# EAGLE board SUMO ROBOT (EAGLE 7.6.0)
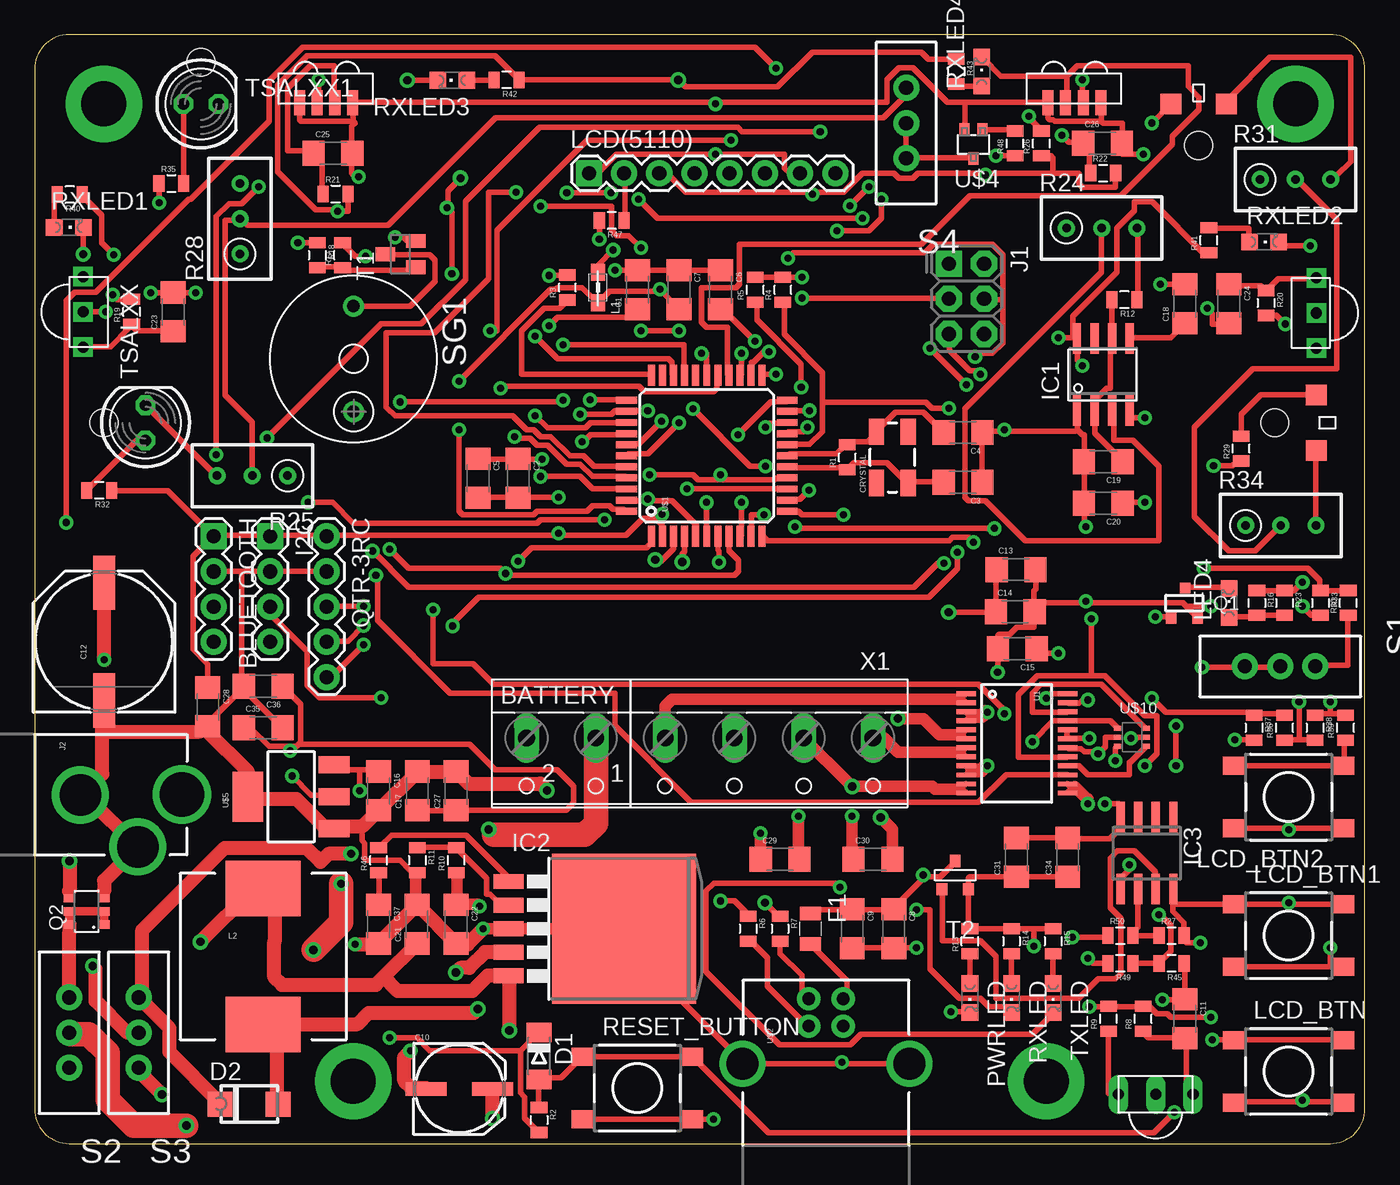
[diagram p2: board, top side]
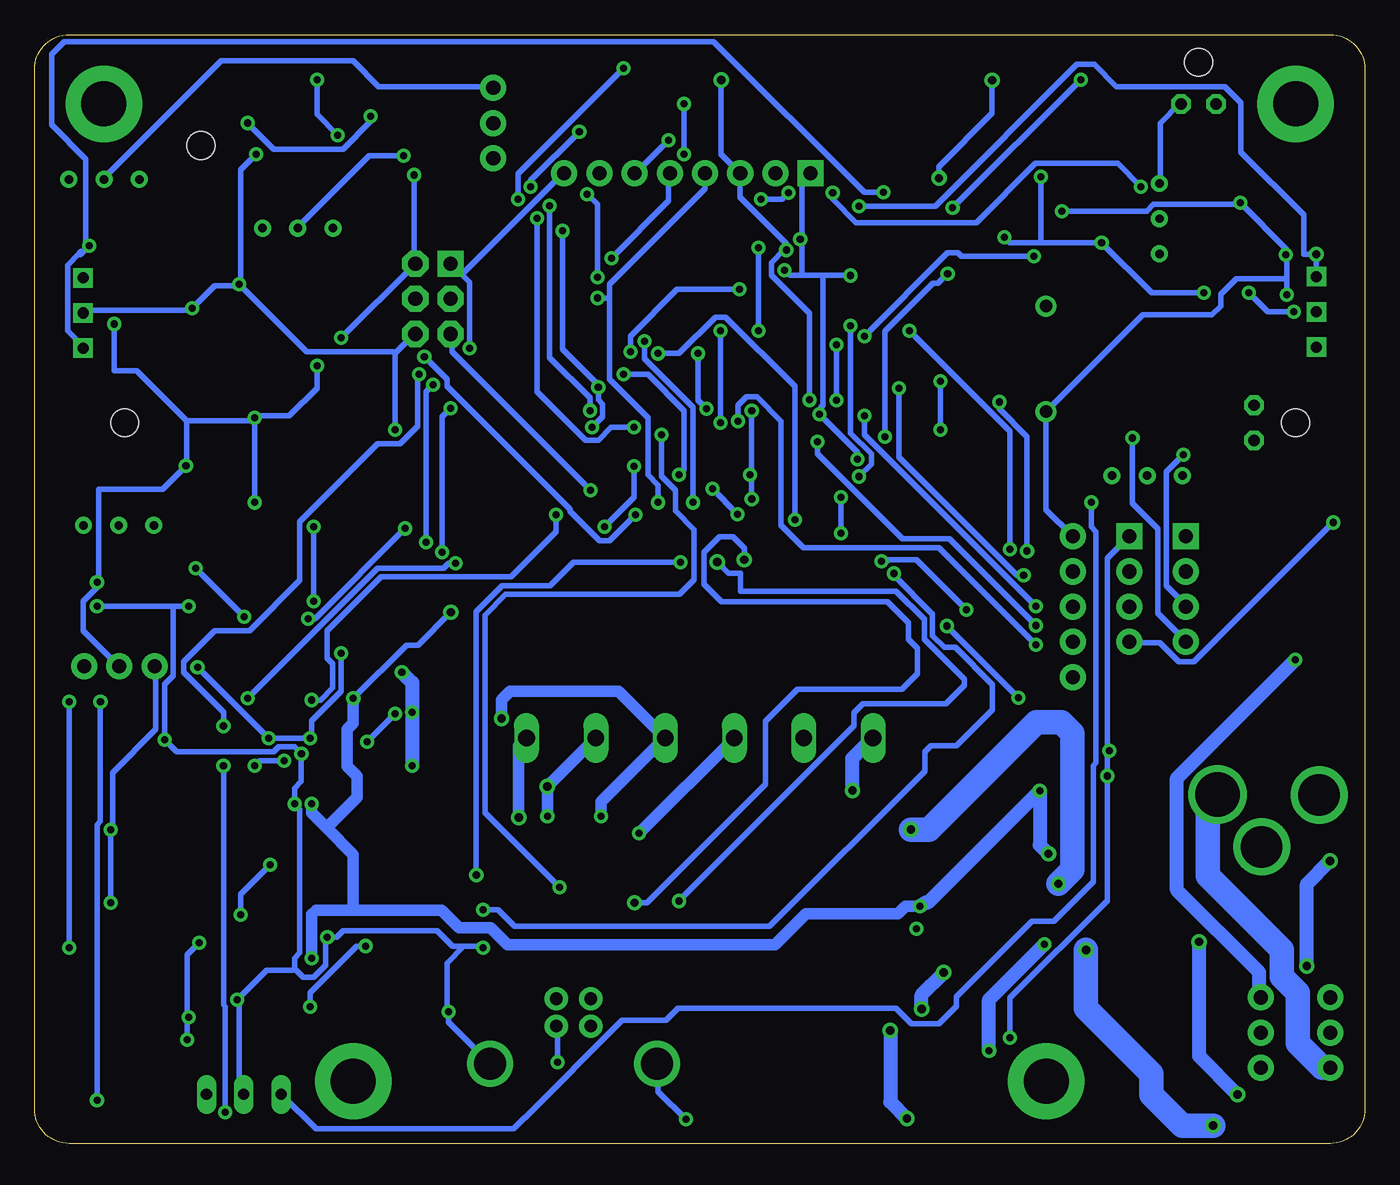
[diagram p3: board, bottom side, seen from below]

Size 96 x 80 mm. Coordinates in mm from the lower left corner, seen from the top.
Outline: 93.5,80 2.5,80 arc90 0,77.5 0,2.5 arc90 2.5,0 93.5,0 arc90 96,2.5 96,77.5 arc90 93.5,80
Copper layers (1*16): Top 0.035mm / dielectric 1.5mm / Bottom 0.035mm
Design rules "SparkFun": minimum track width 8mil, minimum drill 20mil, track to track 8mil, track to pad 8mil, pad to pad 8mil, via to via 8mil, smd to smd 8mil, copper to edge 10mil, drill to drill 8mil, minimum pad ring 12mil, minimum via ring 10mil, stop-mask expansion 4mil, vias tented up to drill 25mil, thermal gap 10mil
Net classes: 0 default: width 0.406 mm, drill 0.254 mm, clearance 0.203 mm; 1 supply: width 1.016 mm, drill 0.254 mm, clearance 0.203 mm
Holes 2 mm at 12,78 84,72 5,52 89.5,52

## Footprints (pad centres in the part's own frame; a part is rotated, then mirrored left to right if it is on the bottom)
W237-102 = drill 1.194 long: 1 -2.5,-1.27; 2 2.5,-1.27
1X04 = drill 1.016 pad 1.88 square: 1 0,0 | drill 1.016 pad 1.88: 2 2.54,0; 3 5.08,0; 4 7.62,0
1206 = smd 1.6 x 1.8: 1 -1.4,0; 2 1.4,0
NIPPON_F80 = smd 2.95 x 1: + 2.4,0; - -2.4,0
PANASONIC_G = smd 3.9 x 1.6: + 4.25,0; - -4.25,0
CRYSTAL-SMD-5X3 = smd 1.9 x 1.1: 1 -1.85,-1.15; 2 1.85,-1.15; 3 1.85,1.15; 4 -1.85,1.15
MINIMELF = smd 1.4 x 1.8: A 1.7,0; C -1.7,0
SMA = smd 1.8 x 1.8: 1 -2.1,-0.1; 2 2.1,-0.1
PTC0805 = smd 1 x 1.5: 1 -1.1,0; 2 1.1,0
SOIC-8 = smd 0.6 x 2.2: 1 -1.905,-2.6; 2 -0.635,-2.6; 3 0.635,-2.6; 4 1.905,-2.6; 5 1.905,2.6; 6 0.635,2.6; 7 -0.635,2.6; 8 -1.905,2.6
TO263-5 = smd 1.067 x 2.159: 1 -3.404,-5.791; 2 -1.702,-5.791; 3 0,-5.791; 4 1.702,-5.791; 5 3.404,-5.791 | smd 10.8 x 10.41: 6 0,2.54
SO08 = smd 0.6 x 2.2: 1 -1.905,-2.6; 2 -0.635,-2.6; 3 0.635,-2.6; 4 1.905,-2.6; 5 1.905,2.6; 6 0.635,2.6; 7 -0.635,2.6; 8 -1.905,2.6
2X3-NS = drill 1.016 pad 1.88 square: 1 -2.54,-1.27 | drill 1.016 pad 1.88 octagon: 2 -2.54,1.27; 3 0,-1.27; 4 0,1.27; 5 2.54,-1.27; 6 2.54,1.27
POWER_JACK_PTH_LOCK = drill 2.997 pad 4.115: GND 0.025,6.557; GNDBREAK 3.762,10.7 | drill 3.2 pad 4.115: PWR 0,13.878
0805 = smd 1.2 x 1: 1 -1.1,0; 2 1.1,0
CDRH125 = smd 5.4 x 4: 1 0,4.9; 2 0,-4.9
1X08 = drill 1.016 pad 1.88 square: 1 0,0 | drill 1.016 pad 1.88: 2 2.54,0; 3 5.08,0; 4 7.62,0; 5 10.16,0; 6 12.7,0; 7 15.24,0; 8 17.78,0
DTSM-6 = smd 1.55 x 1.3: 1 -3.975,2.25; 2 3.975,2.25; 3 -3.975,-2.25; 4 3.975,-2.25
CHIPLED_0805 = smd 1.2 x 1.2: A 0,-1.05; C 0,1.05
SOT-23 = smd 0.762 x 0.762: 1 -0.979,-1.101; 2 0.94,-1.101; 3 0.025,1.067
SOT23-6 = smd 0.6 x 0.8: 1 -0.95,-1.25; 2 0,-1.25; 3 0.95,-1.25; 4 0.95,1.25; 5 0,1.25; 6 -0.95,1.25
1X05 = drill 1.016 pad 1.88: 1 0,0; 2 2.54,0; 3 5.08,0; 4 7.62,0; 5 10.16,0
0805' = smd 0.8 x 1.2: 1 -0.9,0; 2 0.9,0
RTRIM3296W = drill 0.61: 1 0,-2.54; 2 0,0; 3 0,2.54
SWITCH-SPDT = drill 1.016 pad 1.88: 1 0,2.54; 2 0,0; 3 0,-2.54
BMT1205XH7.5 = drill 0.9 pad 1.5: + 3.8,0; - -3.8,0
SOT23-BEC = smd 1 x 1.4: B -0.95,-1.1; C 0,1.1; E 0.95,-1.1
SOT-23' = smd 0.787 x 0.889: 1 0.025,-1.016; 2 -0.94,1.016; 3 0.991,1.016
LED5MM = drill 0.813 octagon: A -1.27,0; K 1.27,0
SSOP24 = smd 0.348 x 1.397: 1 -3.575,-3.656; 2 -2.925,-3.656; 3 -2.275,-3.656; 4 -1.625,-3.656; 5 -0.975,-3.656; 6 -0.325,-3.656; 7 0.325,-3.656; 8 0.975,-3.656; 9 1.625,-3.656; 10 2.275,-3.656; 11 2.925,-3.656; 12 3.575,-3.656; 13 3.575,3.656; 14 2.925,3.656; 15 2.275,3.656; 16 1.625,3.656; 17 0.975,3.656; 18 0.325,3.656; 19 -0.325,3.656; 20 -0.975,3.656; 21 -1.625,3.656; 22 -2.275,3.656; 23 -2.925,3.656; 24 -3.575,3.656
SPARKFUN-DIGITALIC_TQFP44 = smd 1.5 x 0.5: 1 -5.8,4; 2 -5.8,3.2; 3 -5.8,2.4; 4 -5.8,1.6; 5 -5.8,0.8; 6 -5.8,0; 7 -5.8,-0.8; 8 -5.8,-1.6; 9 -5.8,-2.4; 10 -5.8,-3.2; 11 -5.8,-4; 23 5.8,-4; 24 5.8,-3.2; 25 5.8,-2.4; 26 5.8,-1.6; 27 5.8,-0.8; 28 5.8,0; 29 5.8,0.8; 30 5.8,1.6; 31 5.8,2.4; 32 5.8,3.2; 33 5.8,4 | smd 0.5 x 1.5: 12 -4,-5.8; 13 -3.2,-5.8; 14 -2.4,-5.8; 15 -1.6,-5.8; 16 -0.8,-5.8; 17 0,-5.8; 18 0.8,-5.8; 19 1.6,-5.8; 20 2.4,-5.8; 21 3.2,-5.8; 22 4,-5.8; 34 4,5.8; 35 3.2,5.8; 36 2.4,5.8; 37 1.6,5.8; 38 0.8,5.8; 39 0,5.8; 40 -0.8,5.8; 41 -1.6,5.8; 42 -2.4,5.8; 43 -3.2,5.8; 44 -4,5.8
USB-B-PTH = drill 0.914 pad 1.676: D+ 0,1.25; D- 1.981,1.25; GND 0,-1.25; VBUS 1.981,-1.25 | drill 2.286: S1 -2.718,-6.02; S2 -2.718,6.02
OS-1838 = drill 0.8 pad 1.016 long: GND 2.7,1.3; OUT 0,1.3; VCC 5.4,1.3
SOT323 = smd 0.7 x 0.9: 1 -0.65,-1; 2 0.65,-1; 3 0,1.1
SOT223 = smd 1.219 x 2.235: 1 -2.311,-3.099; 2 0,-3.099; 3 2.311,-3.099 | smd 3.6 x 2.2: 4 0,3.099
TSSP7P38 = smd 0.8 x 1.8: 1 -1.94,-0.1; 2 -0.67,-0.1; 3 0.6,-0.1; 4 1.87,-0.1
TSSPXX38 = drill 0.8 square: GND 2.5,1; OUT -0.04,1; VS 5.04,1
SC-70-6 = smd 0.5 x 0.35: A1 -1.05,0.65; A2 -1.05,-0.65; GND -1.05,0; VCC 1.05,0; Y1 1.05,0.65; Y2 1.05,-0.65
IRLED = smd 1.5 x 1.5: P$1 -2,0; P$2 2,0
W237-4 = drill 1.194 long: 1 -7.5,-1.27; 2 -2.5,-1.27; 3 2.5,-1.27; 4 7.5,-1.27

## Placement (x,y rotation side)
BATTERY  [W237-102]  38,28 180 top
BLUETOOTH  [1X04]  12.92,43.81 270 top
C1  100nF  [1206]  43.5,61.6 90 top
C2  100nF  [1206]  34.9,48 270 top
C3  22pF  [1206]  67,47.7 180 top
C4  22pF  [1206]  67,51.3 180 top
C5  100nF  [1206]  32,48 270 top
C6  1uF  [1206]  49.5,61.6 270 top
C7  1uF  [1206]  46.5,61.6 270 top
C8  10uF  [1206]  62,15.5 270 top
C9  100nF  [1206]  59,15.5 270 top
C10  47uF  [NIPPON_F80]  30.65,3.94 0 top
C11  47uF  [1206]  83,9 270 top
C12  680uF  [PANASONIC_G]  5.02,36.21 90 top
C13  10uF  [1206]  70.82,41.41 0 top
C14  100nF  [1206]  70.77,38.37 0 top
C15  100nF  [1206]  70.92,35.69 180 top
C16  10uF  [1206]  24.82,25.44 270 top
C17  10uF  [1206]  27.62,25.44 90 top
C18  10nF  [1206]  83,60.58 90 top
C19  470pF  [1206]  77.12,49.19 180 top
C20  100nF  [1206]  77.12,46.19 180 top
C21  1uF  [1206]  27.59,15.83 90 top
C22  1uF  [1206]  30.42,15.83 270 top
C23  100nF  [1206]  10,60 90 top
C24  100nF  [1206]  86.18,60.58 270 top
C25  100nF  [1206]  21.53,71.45 0 top
C26  100nF  [1206]  77.06,72.17 0 top
C27  100nF  [1206]  30.42,25.44 90 top
C28  100nF  [1206]  12.5,31.5 270 top
C29  100nF  [1206]  53.8,20.5 0 top
C30  100nF  [1206]  60.5,20.5 0 top
C31  100nF  [1206]  70.84,20.65 90 top
C34  100nF  [1206]  74.55,20.65 90 top
C35  100nF  [1206]  16.5,30 0 top
C36  100nF  [1206]  16.5,33 180 top
C37  0.33uF  [1206]  24.82,15.83 270 top
CRYSTAL  16MHZ  [CRYSTAL-SMD-5X3]  61.9,49.5 90 top
D1  [MINIMELF]  36.4,6.32 270 top
D2  [SMA]  15.47,2.93 0 top
F1  [PTC0805]  56,15.5 270 top
I2C  [1X04]  17,43.81 270 top
IC1  IC_555-SOIC8  [SOIC-8]  77.12,55.49 0 top
IC2  LM2577S  [TO263-5]  40,15.5 270 top
IC3  LMV358MX  [SO08]  80.27,20.95 180 top
J1  AVR_SPI_PRG_6NS  [2X3-NS]  67.25,60.95 270 top
J2  POWER_JACKPTH_LOCK  [POWER_JACK_PTH_LOCK]  -3.25,25.17 270 top
L1  MH2029-300Y  [0805]  40.65,61.76 90 top
L2  [CDRH125]  16.5,13.5 0 top
LCD(5110)  [1X08]  40,70 0 top
LCD_BTN  DTSM-6  [DTSM-6]  90.5,5.2 0 top
LCD_BTN1  DTSM-6  [DTSM-6]  90.5,15 0 top
LCD_BTN2  DTSM-6  [DTSM-6]  90.5,25 180 top
LED4  [CHIPLED_0805]  86.2,39 0 top
PWRLED  [CHIPLED_0805]  67.5,10.5 180 top
Q1  [SOT-23]  83,39 0 top
Q2  SI3456BDVSOT-5-6  [SOT23-6]  3.76,16.75 90 top
QTR-3RC  [1X05]  21.08,43.81 270 top
R1  1M  [0805']  58.65,49.5 90 top
R2  10K  [0805']  36.4,1.7 270 top
R3  10K  [0805']  38.45,61.76 90 top
R4  4.7K  [0805']  54,61.6 90 top
R5  4.7K  [0805']  52,61.6 90 top
R6  22R  [0805']  51.5,15.5 270 top
R7  22R  [0805']  53.8,15.5 270 top
R8  47R  [0805']  80,9 90 top
R9  20K  [0805']  77.5,9 90 top
R10  10.5K  [0805']  30.42,20.43 90 top
R11  2K  [0805']  27.62,20.43 270 top
R12  39.2K  [0805']  78.65,60.88 180 top
R13  220R  [0805']  67.5,14.6 90 top
R14  1K  [0805']  70.5,14.6 270 top
R15  1K  [0805']  73.5,14.6 270 top
R16  1K  [0805']  88.2,39 270 top
R17  1K  [0805']  22.23,64.09 90 top
R18  10K  [0805']  20.41,64.09 270 top
R19  100R  [0805']  7,60 90 top
R20  100R  [0805']  88.87,60.64 270 top
R21  100R  [0805']  21.73,68.5 0 top
R22  100R  [0805']  77.11,70.01 0 top
R23  1K  [0805']  90.2,39 270 top
R24  10k  [RTRIM3296W]  77.01,66.05 270 top
R25  1k  [RTRIM3296W]  15.71,48.18 90 top
R26  47R  [0805']  72.65,72.15 90 top
R27  4.7K  [0805']  82.05,15 0 top
R28  1k  [RTRIM3296W]  14.82,66.72 0 top
R29  47R  [0805']  87.07,50.14 90 top
R30  10K  [0805']  94.8,39 90 top
R31  1k  [RTRIM3296W]  90.99,69.56 270 top
R32  47R  [0805']  4.66,47.12 180 top
R33  47K  [0805']  92.8,39 270 top
R34  1k  [RTRIM3296W]  89.93,44.59 270 top
R35  47R  [0805']  9.87,69.26 0 top
R36  1K  [0805']  90.2,30 90 top
R37  10K  [0805']  88,30 270 top
R38  7.5K  [0805']  92.4,30 270 top
R39  68K  [0805']  94.6,30 90 top
R40  1K  [0805']  2.54,68.46 180 top
R41  1K  [0805']  84.73,65.18 90 top
R42  1K  [0805']  34.06,76.73 180 top
R43  1K  [0805']  66.5,77.34 270 top
R45  10K  [0805']  82.05,13 180 top
R46  2.2K  [0805']  24.82,20.43 90 top
R47  220R  [0805']  41.65,66.59 180 top
R48  100R  [0805']  70.75,72.15 90 top
R49  4.7K  [0805']  78.35,13 180 top
R50  2.2K  [0805']  78.35,15 0 top
RESET_BUTTON  DTSM-6  [DTSM-6]  43.5,4 0 top
RXLED  [CHIPLED_0805]  70.5,10.5 180 top
RXLED1  [CHIPLED_0805]  2.46,66.1 270 top
RXLED2  [CHIPLED_0805]  88.72,65.05 270 top
RXLED3  [CHIPLED_0805]  30.15,76.71 90 top
RXLED4  [CHIPLED_0805]  68.35,77.34 0 top
S1  [SWITCH-SPDT]  89.89,34.42 270 top
S2  [SWITCH-SPDT]  2.5,8 180 top
S3  [SWITCH-SPDT]  7.5,8 180 top
S4  [SWITCH-SPDT]  62.9,73.62 180 top
SG1  BMT1205XH7.5  [BMT1205XH7.5]  23.01,56.61 270 top
T1  [SOT23-BEC]  26.4,64.16 90 top
T2  [SOT-23']  66.46,19.36 180 top
TSALXX  [LED5MM]  8,52 90 top
TSALXX1  [LED5MM]  12,75 0 top
TXLED  [CHIPLED_0805]  73.5,10.5 180 top
U1  TB6612FNG  [SSOP24]  70.88,28.87 270 top
U$1  ATMEGA32U4TQFP  [SPARKFUN-DIGITALIC_TQFP44]  48.51,49.62 90 top
U$2  USB+SHIELD  [USB-B-PTH]  57.11,8.47 90 top
U$3  OS-1838  [OS-1838]  78.2,2.25 0 top
U$4  DMG1012UW  [SOT323]  67.75,72.15 180 top
U$5  NCP1117  [SOT223]  18.51,25.03 90 top
U$6  TSSP7P38  [TSSP7P38]  21,75 180 top
U$7  TSSP7P38  [TSSP7P38]  75,75 180 top
U$8  TSSPXX38  [TSSPXX38]  93.5,57.42 90 top
U$9  TSSPXX38  [TSSPXX38]  2.5,62.5 270 top
U$10  NC7WZ14(NOTGATE)  [SC-70-6]  79.19,29.31 0 top
U$11  IRLED  [IRLED]  84,75 180 top
U$12  IRLED  [IRLED]  92.5,52 90 top
X1  [W237-4]  53,28 180 top

## Tracks (layer width: path | path; a pad name or v marks a point on that pad's centre or on a via)
2,6
  Top 0.406: R12.2 77.75,58.12 IC1.6 77.62,58 77.62,54.5 77.38,54.5 76.62,53.75 76.62,53 IC1.2 76.5,52.88 76.5,51.25 78.5,49.25 C19.1
38KHZOUT  (via drill 0.51)
  Top 0.406: v69.38,71.25 R48.1 | IC1.3 77.88,52.88 77.88,50.75 79.25,50.75 81.12,48.88 81.12,43.5 71.5,43.5 68.62,46.38 67.38,46.38 67.12,46.62 67.12,53 77,62.88 77,66 R24.2
  Bottom 0.406: v69.38,71.25 71.88,71.25 77,66.12 R24.2
+5V  (via drill 0.51, 0.6)
  Top 0.406: R16.1 88.25,39.88 90.12,39.88 R23.1 90.38,39.88 90.88,39.88 v91.5,40.5 | S1.2 89.88,34.38 87.38,34.38 S1.3 87.25,34.38 v84.25,34.38 | 74.62,29.25 v76.12,29.25 | 74.62,29.25 U1.19 | U1.20 74.5,29.75 74.5,29.38 74.62,29.25 | v73.88,35.38 72.38,35.38 72.38,35.62 C15.1 | 72.12,15.5 R14.1 R13.2 67.38,15.5 67.38,18.25 T2.2 67.38,18.5 67.38,19.12 67.5,19.25 70.64,19.25 | 72.12,15.5 R15.1 | 70.64,19.25 74.5,19.25 C34.1 | v76.12,9.88 77.38,9.88 R9.2 77.5,9.88 80,9.88 R8.2 80.12,9.88 80.5,9.88 81,9.38 81.75,9.38 82,9.12 v84.88,9.12 | 72.12,15.5 v72.12,14.25 | LCD_BTN2.1 90.5,22.75 | 90.5,22.75 LCD_BTN2.2 | LCD_BTN.2 94.38,7.5 86.62,7.5 LCD_BTN.1 86.38,7.5 v85,7.5 | 82.12,17.25 82.12,18.25 IC3.8 | 82.12,17.25 82.12,16.75 82.95,15.93 R27.2 | 83,15 R27.2 | 82.12,17.25 LCD_BTN1.1 90.5,17.25 | 90.5,17.25 LCD_BTN1.2 | v84.12,14.5 83.12,14.5 83,14.62 83,14.88 R27.2 | v90.5,22.62 90.5,22.75 | v90.5,17.38 90.5,17.25 | v80.12,52.38 79,52.38 79,52.88 IC1.4 | v90.25,59.12 89.62,59.75 R20.2 | v80.12,46.25 78.62,46.25 C20.1 | v73.88,58.12 75.12,58.12 IC1.8 | R5.2 R4.2 v55.38,62.5 | 68.62,70 63.75,70 63.38,69.62 62.38,69.62 62,70 59.75,70 58.38,68.62 56.12,68.62 | 68.62,70 73.5,70 | 73.5,70 75.38,70 75.38,69.25 75.62,69 78,69 R22.2 | 56.12,68.62 47,68.62 45.62,70 LCD(5110).3 | R26.1 73.38,71.25 73.5,71.12 73.5,70 | v56.12,68.5 56.12,68.62 | v68.62,69.88 68.62,70 | v75.62,56.12 75.25,56.5 75.25,58 IC1.8 | 36.38,8 D1.C 36.27,7.92 35.05,6.71 | C27.1 30.38,24 27.62,24 C17.1 | v5.62,61.25 6,60.88 7,60.88 R19.2 | v9,67.88 9,69.25 R35.1 | R21.2 22.62,67.25 v21.88,67.25 21.79,67.36 20.27,67.36 17.53,70.1 17.53,76.35 19.66,78.49 33.22,78.49 34.9,76.81 R42.1 v46.46,76.73 46.97,76.22 53.62,76.22 56.13,78.74 64.01,78.74 64.5,78.24 R43.1
  Top 0.406: C5.2 32,46.62 34.88,46.62 C2.2 35.05,46.63 v37.8,46.63 | v79.12,29.25 79.52,29.25 79.58,29.31 U$10.VCC | R41.1 84.45,64.14 80.64,67.94 79.38,67.94 79.38,67.31 78.11,66.04 78.11,62.87 74.93,59.69 74.93,58.42 IC1.8 | R40.1 3.44,68.37 4.85,66.95 4.85,65 v5.71,64.14 | v85.08,48.89 86.44,48.89 86.56,49.01 86.84,49.01 R29.1 | C31.1 70.64,19.25 | v41.76,64.47 40.69,63.4 40.69,62.94 L1.2 | v40.08,53.65 42.67,53.65 U$1.34 | 44.88,45.03 44.81,45.11 43.89,45.11 42.67,43.89 37.8,43.89 | 44.88,45.03 45.26,44.65 45.26,43.89 U$1.2 | 37.8,43.89 21.18,43.89 QTR-3RC.1 21.03,43.89 17.07,43.89 I2C.1 16.92,43.89 13.11,43.89 BLUETOOTH.1 | v47.09,47.24 54.25,47.24 U$1.14 | 44.88,45.03 v45.26,45.41 | v37.8,44.04 37.8,43.89 | 18.44,28.65 18.9,28.65 19.13,28.88 | 18.44,28.65 16.92,28.65 15.7,29.87 15.24,29.87 C35.1 | 19.13,28.88 19.2,28.96 19.2,31.7 17.98,32.92 C36.1 | 30.48,23.93 C27.1 | 19.13,28.88 19.2,28.8 31.39,28.8 33.22,26.98 37.69,26.98 38.89,25.78 38.89,24.59 38.35,24.05 30.43,24.05 C27.1 | R32.1 5.64,47.09 9.6,47.09 12.8,43.89 BLUETOOTH.1 | C28.1 12.5,32.92 12.5,34.59 11.43,35.66 11.43,42.37 12.8,43.74 BLUETOOTH.1 | 35.05,6.71 35.05,3.66 35.36,3.35 35.36,1.83 36.27,0.91 R2.2 | v18.59,26.52 19.96,25.15 21.49,25.15 U$5.2 | 35.05,6.71 28.5,6.71 27.58,7.62 v25.6,7.62 | v18.44,28.35 18.44,28.65
  Bottom 0.406: S1.2 90,34.5 92.5,37 92.5,39.12 91.5,40.12 v91.5,40.5 91.38,40.62 91.38,47.22 86.75,47.22 v85.08,48.89 85.03,48.94 85.03,52.16 | v73.88,35.38 73.88,32.62 76,30.5 76,29.38 v76.12,29.25 v79.12,29.25 v84.25,34.38 | v76.12,9.88 76.12,10.88 72.75,14.25 v72.12,14.25 | 85,9.12 85,13.62 v84.12,14.5 | 85,9.12 v85,7.5 | v90.5,17.38 v90.5,22.62 90.38,22.75 90.38,26.75 87.25,29.88 87.25,34.38 S1.3 | v84.88,9.12 85,9.12 | v90.25,59.12 90.25,55.75 88.62,55.75 85.03,52.16 | v80.12,52.38 v80.12,46.25 | v73.88,58.12 68.62,63.38 J1.2 68.62,63.62 v68.62,69.88 | v55.38,62.5 55.38,67.75 v56.12,68.5 | v75.62,56.12 75.62,54.5 77.62,52.5 80,52.5 v80.12,52.38 | 5.62,64.14 5.62,64.5 v9,67.88 9.12,67.75 15.25,67.75 15.75,67.25 v21.88,67.25 | 5.62,64.14 5.62,62.38 | 5.62,62.38 v5.62,61.25 | 5.62,62.38 9.29,62.38 10.41,61.26 10.41,60.42 11.03,59.8 16.02,59.8 SG1.+ 23.01,45.74 QTR-3RC.1 | v5.71,64.14 5.62,64.14 | v46.46,76.73 46.46,71.38 LCD(5110).3 45.11,69.8 45.11,68.28 41.76,64.92 v41.76,64.47 41.91,64.47 42.82,63.55 42.82,62.64 40.08,59.89 v40.08,53.65 | 85.03,52.16 80.34,52.16 v80.12,52.38 | v45.26,45.41 v47.09,47.24 | v37.8,44.04 v37.8,46.63 | 18.59,28.35 18.59,42.22 17.07,43.74 I2C.1 | 18.59,28.35 v18.59,26.52 18.59,17.53 25.6,10.52 v25.6,7.62 | v18.44,28.35 18.59,28.35
A0  (via drill 0.51)
  Top 0.406: v36.12,52.5 37,51.62 39.75,51.62 40.12,52 42.62,52 U$1.36 | v23.75,38.75 21.12,38.75 QTR-3RC.3
  Bottom 0.406: v36.12,52.5 36.12,51.12 v23.75,38.75
A1  (via drill 0.51)
  Top 0.406: v39.5,50.62 39.62,50.62 40.12,51.12 42.62,51.12 U$1.37 | v23.75,37.38 22.62,36.25 21.12,36.25 QTR-3RC.4
  Bottom 0.406: v39.5,50.62 39.5,49.75 33.38,43.62 30,43.62 v23.75,37.38
A01  (via drill 0.51)
  Top 0.406: 52.38,20.5 C29.1 | 66.7,32.03 66.81,32.03 | 66.81,32.03 U1.1 | 66.81,32.03 66.99,32.03 U1.2
  Top 0.813: v52.38,22.38 52.38,20.5 | X1.4 45.5,31.55 46,32.05 66.67,32.05 66.7,32.03
  Bottom 0.406: 45.5,29.25 X1.4
  Bottom 0.813: 45.5,29.25 v52.38,22.38
A2  (via drill 0.51)
  Top 0.406: v45.25,52.12 43.62,50.5 42.75,50.5 U$1.38 | v23.75,36 21.5,33.75 21.12,33.75 QTR-3RC.5
  Bottom 0.406: v45.25,52.12 45.25,53.25 44.62,53.88 43.88,53.88 42.12,52.12 42.12,44.62 40.5,43 30.75,43 v23.75,36
A02  (via drill 0.51, 0.6)
  Top 0.406: 55.12,20.5 C29.2 | 66.67,29.52 66.89,29.52 | 66.89,29.52 U1.5 | 66.89,29.52 66.9,29.52 U1.6
  Top 0.813: v55.12,23.62 55.12,20.5 | v62.31,30.66 64.14,30.66 65.3,29.49 66.65,29.49 66.67,29.52
  Bottom 0.406: 50.5,29.25 X1.3 50.55,29.32
  Bottom 0.813: v55.12,23.62 55.12,24.64 X1.3 53.84,32.61 61.7,32.61 62.31,32 v62.31,30.66
A3  (via drill 0.51, 0.6)
  Top 0.406: v46.5,52 44.25,49.75 42.88,49.75 42.75,49.62 U$1.39 | v43.75,58.62 v46.5,58.62 | v43.75,64.62 42.88,65.5 42,65.5 41.62,65.88 41.62,67.62 v36.5,67.62 | 3.5,66.09 RXLED1.C v3.5,64.16
  Bottom 0.406: v46.5,58.62 v46.5,52 | v43.75,64.62 v43.75,58.62 | v36.5,67.62 31,67.62 20.77,77.85 19.53,77.85 17.93,76.25 10.11,76.25 8.94,75.08 8.94,71.53 4.41,67 4.41,64.16 v3.5,64.16 U$9.OUT
A4  (via drill 0.51)
  Top 0.406: v34.75,68.62 32.75,68.62 32.75,62.38 28.88,58.5 25.38,58.5 25.38,53.12 26,52.5 34.5,52.5 35.5,51.5 36,51.5 36.5,51 37.25,51 38.62,49.62 39.62,49.62 40.38,48.88 42.62,48.88 U$1.40 | v92.08,64.77 90.17,64.77 RXLED2.C
  Bottom 0.406: v34.75,68.62 36.12,68.62 47,79.5 93.86,79.5 94.77,78.59 94.77,73.48 92.3,71.02 92.3,65 v92.08,64.77 92.71,64.14 92.79,64.21 | 92.79,64.21 93.62,63.38 93.62,58.62 92.5,57.5 U$8.OUT | 92.79,64.21 92.62,64.38
A5  (via drill 0.51, 0.6)
  Top 0.406: v34.62,51 34.75,50.88 35.75,50.88 36.25,50.38 37,50.38 38.38,49 39.38,49 40.25,48.12 42.62,48.12 U$1.41 | v20.5,76.75 20.5,75.12 U$6.3 | RXLED3.C v26.9,76.71 | v30.73,69.65 29.83,68.75 29.83,67.5 v29.75,67.5 30.11,67.14 v30.11,62.75
  Bottom 0.406: v34.62,51 34.62,58.6 31.18,62.05 30.81,62.05 v30.11,62.75 | v20.5,76.75 v29.75,67.5 | v26.9,76.71 26.9,74.32 30.73,70.48 v30.73,69.65
AIN2
  Top 0.406: U$10.Y1 80.12,30 77,33.12 72.62,33.12 72,32.5 72,31.12 74.5,31.12 U1.22
B01  (via drill 0.51, 0.6)
  Top 0.406: 55.5,29.25 X1.2 | 66.67,25.6 66.88,25.6 | 66.88,25.6 U1.11 | 66.88,25.6 66.92,25.6 U1.12
  Top 0.813: 55.5,29.25 58.75,26 | v59,23.62 59,20.5 C30.1 | v59,25.77 64.78,25.77 64.97,25.58 66.65,25.58 66.67,25.6
  Bottom 0.406: 55.5,29.25 X1.2
  Bottom 0.813: v59,23.62 v59,25.77 X1.2
B02  (via drill 0.6)
  Top 0.406: 66.65,28.27 66.95,28.27 | 66.95,28.27 U1.7 | 66.95,28.27 66.95,28.17 U1.8
  Top 0.813: X1.1 61.28,29.27 62.31,28.25 66.62,28.25 66.65,28.27 | C30.2 61.9,22.68 v61.06,23.52
  Bottom 0.813: v61.06,23.52 61.06,28.71 X1.1
BIN2
  Top 0.406: U1.16 74.62,27.25 75.38,27.25 76,26.62 79,26.62 79,27.5 79.08,27.5 U$10.Y2
CTRL
  Top 0.406: C18.1 83,59.12 82,58.12 79.12,58.12 IC1.5
D4  (via drill 0.51)
  Top 0.406: R9.1 77.5,3.62 78.12,3.62 U$3.OUT | v51,57 51,55.5 U$1.25 | v41.12,45 36.5,45 36.25,44.75 23,44.75 21.5,46.25 v19.75,46.25
  Bottom 0.406: v51,57 49.5,57 46.88,59.62 46.12,59.62 41.12,54.62 v41.12,45 | v19.75,46.25 19.75,44.5 19.41,44.16 19.41,27.46 19.61,27.25 19.61,18.87 22.45,16.03 24.03,16.03 29.46,10.59 29.46,9.91 30.73,8.64 32.72,8.64 33.83,9.75 49.55,9.75 50.42,8.89 53.61,8.89 60.62,1.88 60.63,1.88 61.44,1.07 75.69,1.07 78.12,3.5 U$3.OUT
D5  (via drill 0.51)
  Top 0.406: v23.88,64 23.12,64 22.25,64.88 R17.2 | v36.12,58.25 37.75,56.62 45.75,56.62 46,56.38 46,55.5 U$1.31
  Bottom 0.406: v23.88,64 29.12,64 29.38,64.25 30.12,64.25 v36.12,58.25
D6  (via drill 0.51)
  Top 0.406: v24.62,41 24.75,41 24.75,37.75 30,32.5 41.88,32.5 41.88,30.12 47.38,24.62 68.12,24.62 70.12,26.62 74.5,26.62 U1.15 | v33.62,54.5 33.75,54.62 43.62,54.62 44,54.25 49,54.25 49.25,54.5 49.25,55.38 U$1.27
  Bottom 0.406: v24.62,41 25.12,41 33.62,49.5 v33.62,54.5
D7  (via drill 0.51)
  Top 0.406: U$10.A1 78.12,30 77.62,30.5 74.62,30.5 U1.21 74.38,30.5 73.5,30.5 v72,29 | v34.88,42 35.88,43 44.17,43 44.51,43.34 U$1.1 44.5,43.75 | v28.75,38.5 28.75,34.62 31.62,34.62 33.12,33.12 68.12,33.12 70,31.25 v70,31
  Bottom 0.406: v34.88,42 34.5,42 34.38,42.12 32.38,42.12 v28.75,38.5 | v72,29 v70,31
D8  (via drill 0.51)
  Top 0.406: 78.12,27.62 v78,27.62 78,28.52 U$10.A2 | v80.12,27.25 81,28.12 81,30.88 80.12,30.88 77.25,33.75 76.25,33.75 | 76.25,33.75 72.38,33.75 71,32.38 71,27.88 74.5,27.88 U1.17 | v48.12,57 48.5,57 48.5,55.5 U$1.28 | v47.5,53 51.62,48.88 v52.75,48.88 | v54.88,44.5 55,44.38 v69.25,44.38 | 76.25,33.75 v76.25,37.88
  Bottom 0.406: v78,27.62 79.75,27.62 v80.12,27.25 | v48.12,57 48.12,53.62 v47.5,53 | v52.75,48.88 52.75,46.62 v54.88,44.5 | v69.25,44.38 75.75,37.88 v76.25,37.88
D10  (via drill 0.51)
  Top 0.406: R36.2 90.12,31 88,31 R37.1 87.88,31.12 81.62,31.12 v80.62,32.12 | v38.12,57.62 46.88,57.62 46.88,55.5 U$1.30 | v38.12,53.62 38,53.5 v26.38,53.5 | v24.38,42.75 27,40.13 63.45,40.13 65.19,41.88 v65.62,41.88
  Bottom 0.406: v38.12,53.62 v38.12,57.62 | v26.38,53.5 26.38,53 24.38,51 v24.38,42.75 | v65.62,41.88 66.12,41.88 66.5,41.5 71.25,41.5 v80.62,32.12
D11  (via drill 0.51)
  Top 0.406: v76,32 75.62,32 75.38,31.75 74.62,31.75 U1.23 | v58.38,45.38 55.38,45.38 55.12,45.62 54.38,45.62 U$1.12
  Bottom 0.406: v76,32 75.38,32 74.5,32.88 74.5,34.62 74.88,35 74.88,37 71,40.88 61.62,40.88 58.38,44.12 v58.38,45.38
D12
  Top 0.406: 74.5,77 75.25,77.75 83.25,77.75 83.25,76.27 84.03,75.49 84.03,74.58 82.11,72.66 82.11,72.11 78.38,68.38 67.5,68.38 64,64.88 50.88,64.88 50.88,62 50.62,61.75 48.12,61.75 48.12,59.25 48.5,58.88 50,58.88 50,55.5 U$1.26 | 74.5,77 74.5,75.12 U$7.3 | 74.5,77 69.74,77 RXLED4.C
D+  (via drill 0.51, 0.6)
  Top 0.406: v49.5,17.5 50.5,17.5 51.5,16.5 R6.1 | 46.88,43.75 U$1.4 | 46.89,43.8 U$1.4 | v46.74,41.96 46.74,42.52 46.91,42.7 U$1.4
  Bottom 0.406: v49.5,17.5 36.88,30.12 36.88,31.07 36.22,31.73 30.25,31.73 28.91,33.07 28.91,33.5 31.8,36.4 31.8,37.85 31.83,37.85 33.83,39.85 45.06,39.85 45.06,41.15 45.92,41.15 v46.74,41.96
D-  (via drill 0.6)
  Top 0.406: R7.1 53.68,16.4 v52.7,17.37 | U$1.3 46.11,42.91 45.21,42.01 44.88,42.01 v44.78,42.11
  Bottom 0.406: v52.7,17.37 51.79,17.37 43.26,25.91 43.26,30.45 40.95,32.77 33.4,32.77 32.28,33.88 32.28,35.74 32.94,36.4 32.94,37.57 34.47,39.09 46.43,39.09 47.7,40.36 47.7,42.65 46.58,43.76 45.59,43.76 44.78,42.95 v44.78,42.11
DRAIN
  Top 0.406: S4.3 62.88,76.12 62.88,75.62 61.25,74 33.25,74 25.5,66.25 15.38,66.25 15,66.62 R28.2 14.75,66.62 13.75,66.62 13.75,54 15.71,52.04 R25.2 | R31.2 91.44,69.22 93.98,66.67 93.98,55.88 87.92,55.88 83.7,51.66 83.7,45.23 86.17,42.76 88.1,42.76 R34.2
  Bottom 0.406: S4.3 63,76.25 71.17,76.25 73.03,78.11 82.55,78.11 90.81,69.85 R31.2
GND  (via drill 0.51, 0.6)
  Top 0.406: C5.1 32,49.38 34.88,49.38 C2.1 35,49.38 v36.62,49.38 | 44.25,46.38 46,46.38 47.75,44.62 47.75,43.88 U$1.5 | 44.25,46.38 42.75,46.38 U$1.43 | v44.25,52.88 42.75,52.88 U$1.35 42.5,52.88 41.88,52.88 41.62,52.62 v39.38,52.62 | v44.25,46.5 44.25,46.38 | 49.5,47.88 47.88,47.88 47.5,48.25 v44.38,48.25 | 49.5,47.88 53.38,47.88 53.5,48 54.25,48 U$1.15 | v53.5,55.5 52.62,55.5 U$1.23 | 49.5,47.88 v49.5,48.25 | C6.1 C7.1 C1.2 v41.88,63 | v37.12,62.62 38.38,62.62 R3.2 | v40.75,65.25 R47.2 | LCD(5110).7 54.5,70 54.12,70.38 54.12,71.38 v49.12,71.38 42,71.38 40.62,70 LCD(5110).1 | U1.18 74.62,28.5 75.5,28.5 75.75,28.25 76.62,28.25 v76.75,28.12 77.27,28.64 77.27,29.31 U$10.GND | v77.25,24.5 78.25,24.5 78.38,24.38 78.38,23.62 IC3.4 | 78.38,23.38 IC3.4 | 83.25,38.62 82.88,39 75.88,39 | 83.25,38.62 83.88,38 Q1.2 | 75.88,39 72.12,39 72.12,38.38 C14.2 | v91.5,38.75 92.12,38.12 92.75,38.12 R33.2 | v84.88,38.75 83.38,38.75 83.25,38.62 | v86.62,29.12 88,29.12 R37.2 | C14.2 72.12,39.12 72.12,39.88 72.25,40 72.25,41.38 C13.2 | C14.2 72.12,38.25 72.12,37.25 70.88,37.25 70.38,36.75 69.62,36.75 69.5,36.62 69.5,35.75 C15.2 69.5,35.5 v69.5,34 | v75.88,44.5 75.75,44.62 75.75,46.12 C20.2 75.75,46.38 75.75,49.12 C19.2 75.75,49.38 75.75,51.12 75.62,51.12 75.25,51.5 | v75.88,39.12 75.88,39 | 75.25,51.5 75.25,52.88 IC1.1 | 70,51.38 68.5,51.38 C4.1 68.38,51.12 68.38,47.75 C3.1 | 70,51.38 75.12,51.38 75.25,51.5 | v70,51.5 70,51.38 | C9.2 59,14.12 62,14.12 C8.2 62.12,14.12 v63.62,14.12 | v74.88,14.88 77.5,14.88 77.5,15 R50.1 | 58.25,5.75 51.12,5.75 U$2.S2 51.05,5.94 42.82,14.17 42.82,15.24 IC2.6 42.62,15.5 42.5,15.62 42.38,15.5
  Top 0.406: 58.25,5.75 U$2.S1 | v66.12,9.5 67.5,9.5 PWRLED.C | v58.25,5.88 58.25,5.75 | RESET_BUTTON.3 RESET_BUTTON.4 v49,1.75 | R45.1 83,13 C11.1 82.88,10.38 v81.38,10.38 | v81.25,62 83,62 C18.2 | v84.62,60.25 85,59.88 85,59.12 86.12,59.12 C24.2 | v80,71.38 78.5,71.38 78.5,72.12 C26.2 78.5,72.25 78.5,73.62 77.12,73.62 77,73.75 | 27.5,19.5 R11.2 27.13,19.66 26.36,20.42 23.98,20.42 23.8,20.55 23.8,21.64 23.62,21.87 23.62,22.86 | 27.5,26.75 C17.2 | 24.88,14.38 C37.2 24.62,14.38 | 30.38,14.38 C22.2 30.62,14.38 | v5.12,60 U$9.GND | v8.38,61.38 10,61.38 C23.2 10.12,61.38 v11.62,61.38 | v19,65 20.38,65 R18.1 | v26,65.38 26.62,65.38 26.88,65.12 27.5,65.12 T1.E | v23.38,69.75 23.25,69.88 23,69.88 22.88,70 22.88,71.38 C25.2 22.88,71.62 22.88,73.38 23.12,73.62 23,73.75 | 23,73.75 23,75 U$6.1 23.12,75.12 49.12,75.12 | 23,73.75 19.25,73.75 19.12,73.88 19.12,75 U$6.4 | 67.12,75.12 65.88,75.12 63.38,77.62 62.38,77.62 61.5,76.75 61.5,75.12 49.12,75.12 | 67.12,75.12 73.12,75.12 U$7.4 73.12,75 73.12,74 73.25,73.88 73.5,73.88 73.62,73.75 77,73.75 | 77,73.75 77,75 U$7.1 | 67.12,75.12 67.12,73.25 U$4.2 | 28.25,4 C10.- | v49.12,75 49.12,75.12 | U$10.GND | C31.2 C34.2 74.62,22 77.6,22 78.26,22.66 78.26,23.45 IC3.4 | 67.74,30.81 67.54,30.81 | 67.54,30.81 U1.4 | 67.54,30.81 67.54,30.83 U1.3 | 67.67,26.92 67.55,26.92 | 67.55,26.92 U1.10 | 67.55,26.92 U1.9 | 4.88,31.85 C12.- | 14.94,41.3 16.92,41.3 I2C.2 17.07,41.3 21.03,41.3 QTR-3RC.2 | 14.94,41.3 12.95,41.3 BLUETOOTH.2 | 24.54,23.77 C16.2 | C36.2 15.09,32.92 12.65,30.48 12.65,30.18 C28.2 12.34,30.02 | C35.2 17.83,30.02 15.09,32.77 C36.2 | 14.94,41.3 14.94,33.07 C36.2
  Top 0.61: 5,18.21 Q2.3
  Top 0.813: 24.82,14.46 C37.2 24.77,14.38 | 27.62,17.23 C21.2 27.5,17.32 27.5,19.5 | v32.38,15.5 IC2.3 IC2.6 | 27.19,4 27.19,4.03
  Top 1.016: 24.82,14.46 C21.2 | 27.62,17.23 C22.2 | C16.2 C17.2 C27.2 31.3,25.96 36.5,25.96 v36.98,25.48 | 30.62,14.38 31.25,14.38 v32.38,15.5 | 28.25,4 27.19,4 | 27.19,4.03 26.67,4.55 26.67,6.25 v27.12,6.69 | v23.12,14.38 24.77,14.38 | v68.75,31.12 68.64,31.12 68.35,30.84 67.77,30.84 67.74,30.81 | v68.75,27.25 68.65,27.25 68.3,26.9 67.69,26.9 67.67,26.92 | 24.54,23.77 23.62,22.86 21.64,22.86 U$5.1 21.49,22.86 20.88,22.86 18.9,24.84 15.85,24.84 U$5.4 15.39,25.15 15.39,26.82 12.34,29.87 C28.2 11.89,29.72 4.88,29.72 | 4.88,29.72 4.88,26.67 3.35,25.15 J2.GND 3.81,24.99 7.32,21.49 J2.GNDBREAK 5,18.97 5,18.21 | 4.88,29.72 4.88,31.7 C12.-
  Bottom 0.406: v44.25,46.5 44.25,48.25 | 44.25,48.25 v44.25,52.88 | v44.38,48.25 44.25,48.25 | v53.5,55.5 51.75,55.5 49.12,52.88 49.12,48.62 v49.5,48.25 | v36.62,49.38 36.62,49.88 v39.38,52.62 39.25,52.75 39.25,53.12 39.12,53.25 39.12,62.62 | 40.62,62.62 41.5,62.62 v41.88,63 | 40.62,62.62 39.12,62.62 | 39.12,62.62 v37.12,62.62 | 40.62,62.62 40.62,65.12 v40.75,65.25 40.62,65.38 40.62,69.38 LCD(5110).1 | v84.88,38.75 86,38.75 | 86,38.75 v91.5,38.75 | 86,38.75 86,33.75 86.62,33.12 v86.62,29.12 85.75,28.25 78.75,28.25 78.38,28.62 77.25,28.62 v76.75,28.12 76.75,26.12 77.25,25.62 v77.25,24.5 76.88,24.12 76.88,13.75 77.25,13.38 77.25,12.62 | v75.88,44.5 v75.88,39.12 | 70,57 v70,51.5 | 70,57 68.62,58.38 J1.6 | 77.25,12.62 76.62,12 75.88,12 75,12.88 75,14.75 v74.88,14.88 74.2,14.88 73.74,15.34 66.95,15.34 65.84,14.22 65.05,14.22 | U$2.S1 63.25,5.88 66.12,8.75 v66.12,9.5 66.25,9.62 66.25,13.02 65.05,14.22 | v58.25,5.88 58.25,8.38 U$2.GND | v49,1.75 51,3.75 51,5.75 U$2.S2 | 77.25,12.62 77.38,12.5 79.25,12.5 v81.38,10.38 81.25,10.25 81.25,3.88 81,3.62 U$3.GND | v81.25,62 76.38,57.12 70.12,57.12 70,57 | v81.25,62 81.38,61.88 83,61.88 v84.62,60.25 84.75,60.12 92.38,60.12 92.5,60 U$8.GND | v80,71.38 81.12,70.25 81.12,62.12 v81.25,62 | v5.12,60 7,60 v8.38,61.38 | 23.38,65 25.62,65 v26,65.38 | 23.38,65 v19,65 15.38,61.38 v11.62,61.38 | v23.38,69.75 23.38,65 | v49.12,75 v49.12,71.38 | 65.05,14.22 63.72,14.22 v63.62,14.12
  Bottom 1.016: v27.12,6.69 27.12,10.38 v23.12,14.38 | v68.75,27.25 v68.75,31.12 68.75,33.25 v69.5,34 | 35.5,28.96 BATTERY.2 36.98,27.79 v36.98,25.48
MISO  (via drill 0.51)
  Top 0.406: v67.75,43.38 67.38,43.75 66.25,43.75 66,43.5 52.88,43.5 52.62,43.75 U$1.11 | v64.62,57.38 v67.25,54.75
  Bottom 0.406: v67.75,43.38 67.75,54.25 v67.25,54.75 | v64.62,57.38 64.62,62.12 65.88,63.38 J1.1 65.12,62.75 57.88,70 LCD(5110).8
MOSI  (via drill 0.51)
  Top 0.406: v52.62,45.38 51.75,45.38 51.75,43.88 U$1.10 | v67.88,56.75 68.12,57 69.12,57 69.88,57.75 69.88,60.88 | 69.88,60.88 68.62,60.88 J1.4 | v54.38,63.88 54.75,64.25 64.25,64.25 64.88,64.88 69.12,64.88 69.88,64.12 69.88,60.88
  Bottom 0.406: v52.62,45.38 54.5,43.5 55.25,43.5 57.38,45.62 57.38,45.75 66.25,54.62 66.25,55.12 v67.88,56.75 | v54.38,63.88 50.25,68 50.25,70 LCD(5110).5
N$1  (via drill 0.51)
  Top 0.406: 45.12,61.5 45.25,61.5 46.5,60.25 C7.2 | 45.12,61.5 41.5,61.5 40.75,60.75 L1.1 40.5,60.75 39.5,61.75 37.75,61.75 37.62,61.62 37.25,61.62 v30.62,55 | v30.62,51.5 30.62,45.62 30.88,45.38 36,45.38 36.25,45.62 39.88,45.62 40.25,46 41.5,46 41.75,45.75 42.5,45.75 42.62,45.62 U$1.44 | v53,57.12 52.62,57.12 51.88,56.38 51.75,56.38 51.75,55.5 U$1.24 | v45.12,61.62 45.12,61.5
  Bottom 0.406: v30.62,55 v30.62,51.5 | v53,57.12 53,58.25 49.62,61.62 v45.12,61.62
N$2  (via drill 0.51)
  Top 0.406: v36.5,48.12 39.38,48.12 40.25,47.25 42.62,47.25 U$1.42 | v37.12,59 37.75,59.62 43,59.62 43.5,60.12 C1.1
  Bottom 0.406: v36.5,48.12 35.62,49 35.62,49.75 37.12,51.25 v37.12,59
N$3  (via drill 0.51)
  Top 0.406: v48.5,46.25 48.5,43.88 U$1.6 | v52,57.88 49.75,60.12 49.5,60.12 C6.2
  Bottom 0.406: v48.5,46.25 48.5,53.12 52,56.62 v52,57.88
N$4
  Top 0.406: U$1.17 54.38,49.62 54.5,49.75 57.88,49.75 58.5,50.38 R1.2 58.88,50.62 60.12,50.62 60.75,51.25 CRYSTAL.3 60.88,51.5 62.12,52.75 64.12,52.75 65.5,51.38 C4.2
N$5
  Top 0.406: C3.2 65.5,47.75 63.12,47.75 CRYSTAL.1 62.88,47.75 61.5,49.12 59.12,49.12 58.75,48.75 R1.1 58.5,48.75 54.38,48.75 U$1.16
N$6
  Top 0.406: F1.2 56,14.38 58.62,11.75 58.62,10.5 58.38,10.5 U$2.VBUS
N$7
  Top 0.406: R3.1 38.38,60.75 37.88,60.25 36.75,60.25 35.12,58.62 35.12,55.5 44.5,55.5 U$1.33
N$8
  Top 0.406: R39.1 94.5,29 94.5,27.25 LCD_BTN2.3 LCD_BTN2.4
N$9
  Top 0.406: 53.88,14.5 R7.2 53.8,13.7 55.38,12.12 55.38,10.88 55.75,10.5 U$2.D-
N$10
  Top 0.406: U$2.D+ 55.75,8.5 52.9,11.35 52.9,13.4 51.7,14.6 R6.2
N$11  (via drill 0.51)
  Top 0.406: R49.1 R45.2 81.25,13.12 82,13.88 82,15.75 81.25,16.5 v81.12,16.5 | v79,20.12 79,19.75 78.38,19.12 78.38,18.38 IC3.5
  Bottom 0.406: v81.12,16.5 81.12,18 v79,20.12
N$12
  Top 0.406: R8.1 80,8 80.38,7.62 83,7.62 C11.2 83.12,7.5 83.12,3.62 83.5,3.62 U$3.VCC
N$14
  Top 0.406: R13.1 PWRLED.A
N$15
  Top 0.406: R11.1 27.62,21.38 30.38,21.38 R10.2 32.62,19.12 32.62,18 32.88,18 33.62,17.25 34.12,17.25 IC2.2
N$16
  Top 0.406: U$4.1 68.5,73.12 70.75,73.12 R48.2
N$17  (via drill 0.51)
  Top 0.406: 91.25,29.12 92.38,29.12 R38.2 | 91.25,29.12 90.25,29.12 R36.1 | 91.5,3 94.38,3 LCD_BTN.4 | 91.5,3 86.62,3 LCD_BTN.3 | v91.25,31.88 91.25,29.12 | v91.5,3.12 91.5,3
  Bottom 0.406: v91.25,31.88 91.25,23.25 91.5,23 v91.5,3.12
N$18  (via drill 0.51)
  Top 0.406: 93.5,31 94.5,31 R39.2 | 93.5,31 92.5,31 R38.1 | LCD_BTN1.4 93.5,12.75 | 93.5,12.75 LCD_BTN1.3 | v93.5,31.88 93.5,31 | 93.5,12.75 v93.5,14.12
  Bottom 0.406: v93.5,14.12 v93.5,31.88
N$21
  Top 0.406: RXLED1.A 1.41,68.24 R40.2
N$22
  Top 0.406: R14.2 RXLED.A
N$23
  Top 0.406: R15.2 TXLED.A
N$24
  Top 0.406: LED4.A 86.25,38 88.12,38 R16.2 88.38,38.12 90.12,38.12 R23.2
N$25
  Top 0.406: R18.2 20.5,63.25 22.12,63.25 R17.1 22.25,63 27.38,63 27.5,63.12 T1.B
N$26
  Top 0.406: R27.1 R50.2 79.25,15.22 79.63,15.6 IC3.6 79.75,18.25
N$27
  Top 0.406: 25.38,64.12 T1.C 25.33,64.13 28.5,64.13 28.89,63.74 28.89,62.2 27.1,60.41 SG1.-
N$28
  Top 0.406: T2.3 65.5,18.25 65.5,14.62 68.25,14.62 69.38,13.5 69.38,10.5 75.38,10.5 76.75,11.88 78,11.88 78.38,12.25 78.38,16.25 77.62,17 77.62,20.6 78.15,21.12 79.38,21.12 80.88,19.62 80.88,18.38 IC3.7
N$29
  Top 0.406: R12.1 79.62,61 79.62,66 R24.3
N$30
  Top 0.406: R41.2 85.09,66.04 87.63,66.04 87.63,65.41 RXLED2.A
N$31
  Top 0.406: U$4.3 67.75,71.12 63,71.12 S4.1 62.88,71.25 62.88,73.5 S4.2
N$32  (via drill 3.25 pad 5.5)
  other vias: 5,75
N$33
  Top 0.406: R25.3 13.09,48.18 TSALXX.K
N$34
  Top 0.406: TSALXX.A 7.37,50.73 R32.2
N$35
  Top 0.406: Q1.3 83.12,40.12 86.12,40.12 LED4.C
N$36  (via drill 3.25 pad 5.5)
  other vias: 91,75
N$37
  Bottom 0.406: R28.3 14.75,69.38 14.75,73.62 13.38,75 TSALXX1.K
N$38
  Top 0.406: R35.2 10.75,69.38 10.75,75 TSALXX1.A
N$39
  Top 0.406: R30.1 94.75,38 94.75,34.5 92.5,34.5 S1.1
N$40  (via drill 0.51)
  Top 0.406: v80.88,38 82,38 Q1.1 | v84.38,41.5 91.88,41.5 92.75,40.62 92.75,40 R33.1 93,39.88 94.75,39.88 R30.2
  Bottom 0.406: v84.38,41.5 v80.88,38
N$41
  Top 0.406: U$11.P$1 86.36,75.56 89.15,78.36 94.97,78.36 94.97,70.84 93.98,69.85 R31.3
N$42  (via drill 0.51)
  Top 0.406: v71.75,74.12 71.75,74 72.62,73.12 R26.2 | U$11.P$2 v80.62,73.62
  Bottom 0.406: v71.75,74.12 71.75,73.75 73.75,71.75 78.75,71.75 v80.62,73.62
N$43  (via drill 3.25 pad 5.5)
  other vias: 73,4.5
N$44  (via drill 3.25 pad 5.5)
  other vias: 23,4.5
N$45
  Top 0.406: R34.3 92.47,49.97 U$12.P$1
N$46
  Top 0.406: R29.2 87.07,52.6 88.48,54.01 U$12.P$2
N$49
  Top 0.61: Q2.6 Q2.5 Q2.2 Q2.1
  Top 1.016: S2.3 2.5,15.28 2.52,15.29 Q2.6
N$50
  Top 0.406: RXLED3.A 33.14,76.71 R42.2
N$51  (via drill 0.6)
  Top 0.61: 2.49,18.24 2.49,17.72 Q2.4
  Top 1.016: S3.2 6.68,8 4.39,10.29 4.39,12.6 v4.19,12.8 | v2.52,20.4 2.52,18.26 2.49,18.24
  Bottom 1.016: v4.19,12.8 4.19,18.72 v2.52,20.4
N$52
  Top 0.406: R46.2 24.88,21.38 25.75,22.25 31.12,22.25 34.12,19.25 34.12,19 IC2.1
N$53
  Top 0.406: R46.1 24.88,19.5 24.88,17.25 C37.1
N$54  (via drill 0.6)
  Top 1.016: 33.15,22.28 v32.77,22.66
  Top 1.778: BATTERY.1 40.5,23.08 39.7,22.28 33.15,22.28 | v22.12,18.75 22.12,15.98 v20.12,13.97 | S2.2 2.6,7.9 3.91,7.9 5.26,6.55 5.26,3.17 7.14,1.29 v10.95,1.29
  Bottom 1.778: v32.77,22.66 31.45,22.66 23.72,30.38 21.89,30.38 21.11,29.59 21.11,19.76 v22.12,18.75 | v20.12,13.97 20.12,9.78 15.39,5.05 15.39,3.5 13.18,1.29 v10.95,1.29
N$55
  Top 0.406: R47.1 42.62,66.62 42.62,70 LCD(5110).2
N$56
  Top 0.406: RXLED4.A 66.65,76.29 R43.2
N$57
  Bottom 1.778: J2.PWR 11.33,24.47 11.33,19.33 5.99,13.99 5.99,12.04 4.83,10.87 4.85,10.85 4.85,7.24 3.07,5.46 S2.1
RESET  (via drill 0.51)
  Top 0.406: R2.1 36.38,2.62 36.38,4.5 D1.A 36.5,4.75 38,4.75 39.5,6.25 RESET_BUTTON.1 RESET_BUTTON.2 47.62,6.12 52.96,0.79 80.79,0.79 v82.25,2.25 | v55.88,47.12 55.25,46.5 54.38,46.5 U$1.13 | v82.38,30.12 v82.38,27.25 | v68.25,55.5 68,55.75 67.5,55.75 66,57.25 66,58.38 J1.5
  Bottom 0.406: v55.88,47.12 65.88,57.12 65.88,58.38 J1.5 | v82.25,2.25 82.25,9.88 82.38,10 v82.38,27.25 | v82.38,30.12 82.38,31.12 85.25,34 85.25,34.75 83,37 80.5,37 76.88,40.62 76.88,44.88 71.25,50.5 69.62,50.5 68.38,51.75 68.38,55.38 v68.25,55.5
RX  (via drill 0.51)
  Top 0.406: v52.73,51.66 53.03,51.97 54.25,51.97 U$1.20 | v59.74,66.75 44.96,66.75 v43.59,68.12 | v38.41,68.58 v41.6,68.58 | v16.15,69.04 14.94,67.82 14.02,67.82 13.11,66.9 v13.11,49.68
  Bottom 0.406: v52.73,51.66 54.41,51.66 55.32,50.75 56.24,50.75 59.74,54.25 v59.74,66.75 | v43.59,68.12 42.06,68.12 v41.6,68.58 | v38.41,68.58 38.41,68.12 36.73,66.45 28.04,66.45 23.77,70.71 17.83,70.71 v16.15,69.04 | v13.11,49.68 14.33,48.46 14.33,40.23 12.95,38.86 BLUETOOTH.3
RXLED  (via drill 0.51)
  Top 0.406: v63.62,16.88 64.62,16.88 64.62,12.62 66.75,10.5 68.25,10.5 68.88,9.88 70.12,9.88 70.5,9.5 RXLED.C | 50.12,43.75 U$1.8 50.11,42.77 50.8,42.09 50.8,41.3 50.49,41 49.74,41 34.12,41 v34,41.12 33.62,41.5 27,41.5 v25.62,42.88 | v50.25,72.38 39.88,72.38 33.38,65.88 33.38,58.62 v32.88,58.62
  Bottom 0.406: v34,41.12 34,41 31.19,38.19 31.19,36.65 30.33,35.79 29.57,35.79 26.87,33.1 26.87,31.29 29.46,28.7 31.32,28.7 31.75,28.27 31.75,26.88 42.95,15.67 61.37,15.67 62.57,16.88 v63.62,16.88 | v50.25,72.38 52.62,70 LCD(5110).6 | v32.88,58.62 25.62,51.38 v25.62,42.88
SCK  (via drill 0.51)
  Top 0.406: v51,46.25 51,43.88 U$1.9 | v55.38,61 65.88,61 J1.3
  Bottom 0.406: v51,46.25 51,47.5 51.75,48.25 51.75,52.38 54.5,55.12 54.5,61 | 54.5,61 54.5,62 47.62,68.88 LCD(5110).4 | 54.5,61 v55.38,61
SCL  (via drill 0.51)
  Top 0.406: 56.84,53.49 56.84,51.36 55.93,50.44 54.41,50.44 U$1.18 | 56.84,53.49 56.84,55.63 54.1,58.37 54.1,60.66 R4.1 | v24.99,32.16 20.57,32.16 19.66,33.07 19.66,35.51 17.07,38.1 17.07,38.71 I2C.3 | v66.6,42.67 66.6,41.45 64.55,39.4 32.03,39.4 30.18,37.55 v30.18,37.34 | v65.99,53.03 64.77,53.03 64.31,53.49 56.84,53.49
  Bottom 0.406: v30.18,37.34 v24.99,32.16 | v66.6,42.67 66.6,52.43 v65.99,53.03
SDA  (via drill 0.51)
  Top 0.406: v55.32,54.56 55.32,56.24 52.12,59.44 52.12,60.66 R5.1 | v55.78,51.66 55.47,51.36 54.41,51.36 U$1.19 | v2.29,44.81 2.29,60.81 2.9,61.42 4.42,61.42 11.12,68.12 11.28,68.12 16.92,73.76 16.92,76.66 19.36,79.1 51.97,79.1 v53.49,77.57 | v61.11,68.12 61.11,66.75 60.2,65.84 v57.91,65.84
  Bottom 0.406: v55.78,51.66 55.02,52.43 55.02,53.34 55.32,53.65 v55.32,54.56 55.32,54.71 57.91,57.3 v57.91,65.84 | v2.29,44.81 12.34,34.75 13.41,34.75 14.78,36.12 16.92,36.12 I2C.4 | v53.49,77.57 61.11,69.95 v61.11,68.12
TX  (via drill 0.51)
  Top 0.406: v55.93,52.88 54.41,52.88 U$1.21 | v60.2,69.04 v58.83,67.67 | v56.69,73 51.05,73 50.75,73.3 36.42,73.3 31.09,67.97 31.09,62.33 27.89,59.13 24.99,59.13 v16.76,50.9
  Bottom 0.406: v55.93,52.88 55.93,53.8 58.83,56.69 v58.83,67.67 | v60.2,69.04 60.2,69.49 v56.69,73 | v16.76,50.9 16.76,46.18 14.94,44.35 14.94,38.25 12.95,36.27 BLUETOOTH.4
TXLED  (via drill 0.51)
  Top 0.406: v50.75,51.12 53.12,53.5 54.25,53.5 U$1.22 | TXLED.C 73.5,9.38 72,7.88 59.62,7.88 58.88,7.12 53.75,7.12 48.46,12.41 48.46,18.24 49.02,18.8 57.83,18.8 v58.12,18.5
  Bottom 0.406: v58.12,18.5 63.5,23.88 63.5,38.12 62,39.62 49.48,39.62 48.41,40.69 48.41,44.3 49.75,45.63 49.75,47.12 50.75,48.12 v50.75,51.12
V_BATT  (via drill 0.51, 0.6)
  Top 0.406: C14.1 | C13.1 69.38,41.38 C14.1 | 30.5,19.5 R10.1 | 30.5,17.25 C22.1 | R49.2 76.38,13 v76,13.38 | U1.24 73.32,32.45 v73,32.12 | v65.96,38.33 69.33,38.33 C14.1 | 75.08,25.73 74.75,25.73 | 74.75,25.73 U1.14 | 74.75,25.73 74.75,25.51 U1.13 | 23.47,26.98 21.95,26.98 21.64,27.28 U$5.3 | 23.47,26.98 24.69,26.98 C16.1 | v23.47,25.45 23.47,26.98
  Top 0.813: D2.1 13.37,2.95 | 30.5,19.5 30.5,17.31 C22.1 | 30.5,17.25 32,17.25 v32.12,17.12 | v76,24.5 76,24.86 75.95,24.86 75.08,25.73
  Top 1.016: 13.37,2.95 9.73,6.59 9.73,8.31 S3.3 7.77,10.82 7.77,15.39 13.72,21.34 19.61,21.34 20.62,20.32 21.21,20.9 v22.84,20.9 | v5.03,34.9 5.03,40.39 C12.+
  Bottom 0.406: v73,32.12 69.16,35.97 68.33,35.97 v65.96,38.33 | 31.85,17.37 v32.12,17.12
  Bottom 0.813: 73.1,16.84 66.62,16.84 65.35,15.57 63.09,15.57 61.87,14.35 42.57,14.35 40.34,16.59 33.68,16.59 33.14,17.12 v32.12,17.12 | 73.1,16.84 75.69,16.84 76,16.54 v76,13.38 | v76,24.5 76,23.85 74.92,22.77 | 74.92,22.77 73,20.85 73,16.94 73.1,16.84 | v73,32.12 73,30.33 73.43,29.9 73.43,27.2 72.72,26.49 72.72,24.97 74.92,22.77
  Bottom 1.016: v32.12,17.12 31.7,17.37 31.55,17.37 v23.47,25.45 23.47,21.54 v22.84,20.9 | v5.03,34.9 13.56,26.36 13.56,18.29 7.62,12.34 7.62,10.67 S3.3
VIN  (via drill 0.6)
  Top 0.406: 34.25,12 IC2.5
  Top 0.813: 7.52,5.44 S3.1 | L2.1 17.31,18.4 | C21.1 27.71,14.43 | 34.19,12.12 IC2.5
  Top 1.016: 25.18,12.02 24.61,11.45 23.32,11.45 23.32,11.46 17.86,11.46 17.3,12.01 17.3,14.55 17.31,14.57 17.31,18.4 | 25.18,12.02 C21.1 | 34.19,12.12 32.7,12.12 31.58,11 26.2,11 25.18,12.02 | 34.25,12 v34.25,8.16 | v33.05,1.8 C10.+ | 7.52,5.44 7.52,5.21 v9.2,3.53 | v11.96,14.55 15.81,18.4 L2.1
  Bottom 1.016: v34.25,8.16 34.25,3.01 v33.05,1.8 | v9.2,3.53 11.96,6.3 v11.96,14.55
VS1
  Top 0.406: C23.1 10,58.62 7.38,58.62 7,59 R19.1 6.88,58.88 5.5,57.5 3.5,57.5 U$9.VS
VS2
  Top 0.406: C24.1 86.25,61.88 88.5,61.88 88.75,61.62 R20.1 89,61.62 89.75,62.38 92.5,62.38 U$8.VS
VS3
  Top 0.406: R21.1 20.75,68.5 20.75,71.38 20.25,71.38 C25.1 20.12,71.62 18.25,71.62 18.25,76.12 19.88,77.75 21.62,77.75 21.62,75.12 U$6.2
VS4  (via drill 0.51)
  Top 0.406: R22.1 76.12,70.12 76.12,72.12 75.75,72.12 C26.1 75.5,72.25 74.62,72.25 v74.12,72.75 | v75.62,76.75 75.62,75.12 U$7.2
  Bottom 0.406: v75.62,76.75 75.62,74.25 v74.12,72.75
VSW  (via drill 0.6)
  Top 0.406: 17.5,8.5 16.5,8.5 L2.2 17.62,8.62 | 17.5,2.88 D2.2 | 34.12,13.75 IC2.4
  Top 0.813: 31.7,9.42 v31.99,9.71 | 34.2,13.81 IC2.4 | 17.5,7.6 L2.2
  Top 1.016: 31.7,9.42 28.02,9.42 24.11,9.42 23.31,8.62 17.62,8.62 | 17.5,2.88 17.5,7.6 | 34.2,13.81 32.5,13.81 31.37,12.68 30.73,12.68 v30.39,12.33
  Bottom 1.016: v31.99,9.71 31.99,10.73 v30.39,12.33
VUSB  (via drill 0.51)
  Top 0.406: F1.1 56,16.62 56.25,16.88 59,16.88 C9.1 59.12,16.88 61.88,16.88 C8.1 62,17 64.25,19.25 | 64.25,19.25 65.38,19.25 66.38,20.25 T2.1 | 49.25,43.75 U$1.7 49.3,42.85 49.4,42.75 v49.4,41.95 | v64.12,19.38 64.25,19.25
  Bottom 0.406: v64.12,19.38 64.12,38.38 62.25,40.25 58.81,40.25 57.12,41.94 49.41,41.94 v49.4,41.95